# Altium schematic sheet DAC.SchDoc
size Tabloid; DocumentNumber: 7; SheetNumber: 7; SheetTotal: 11; SheetName: DAC
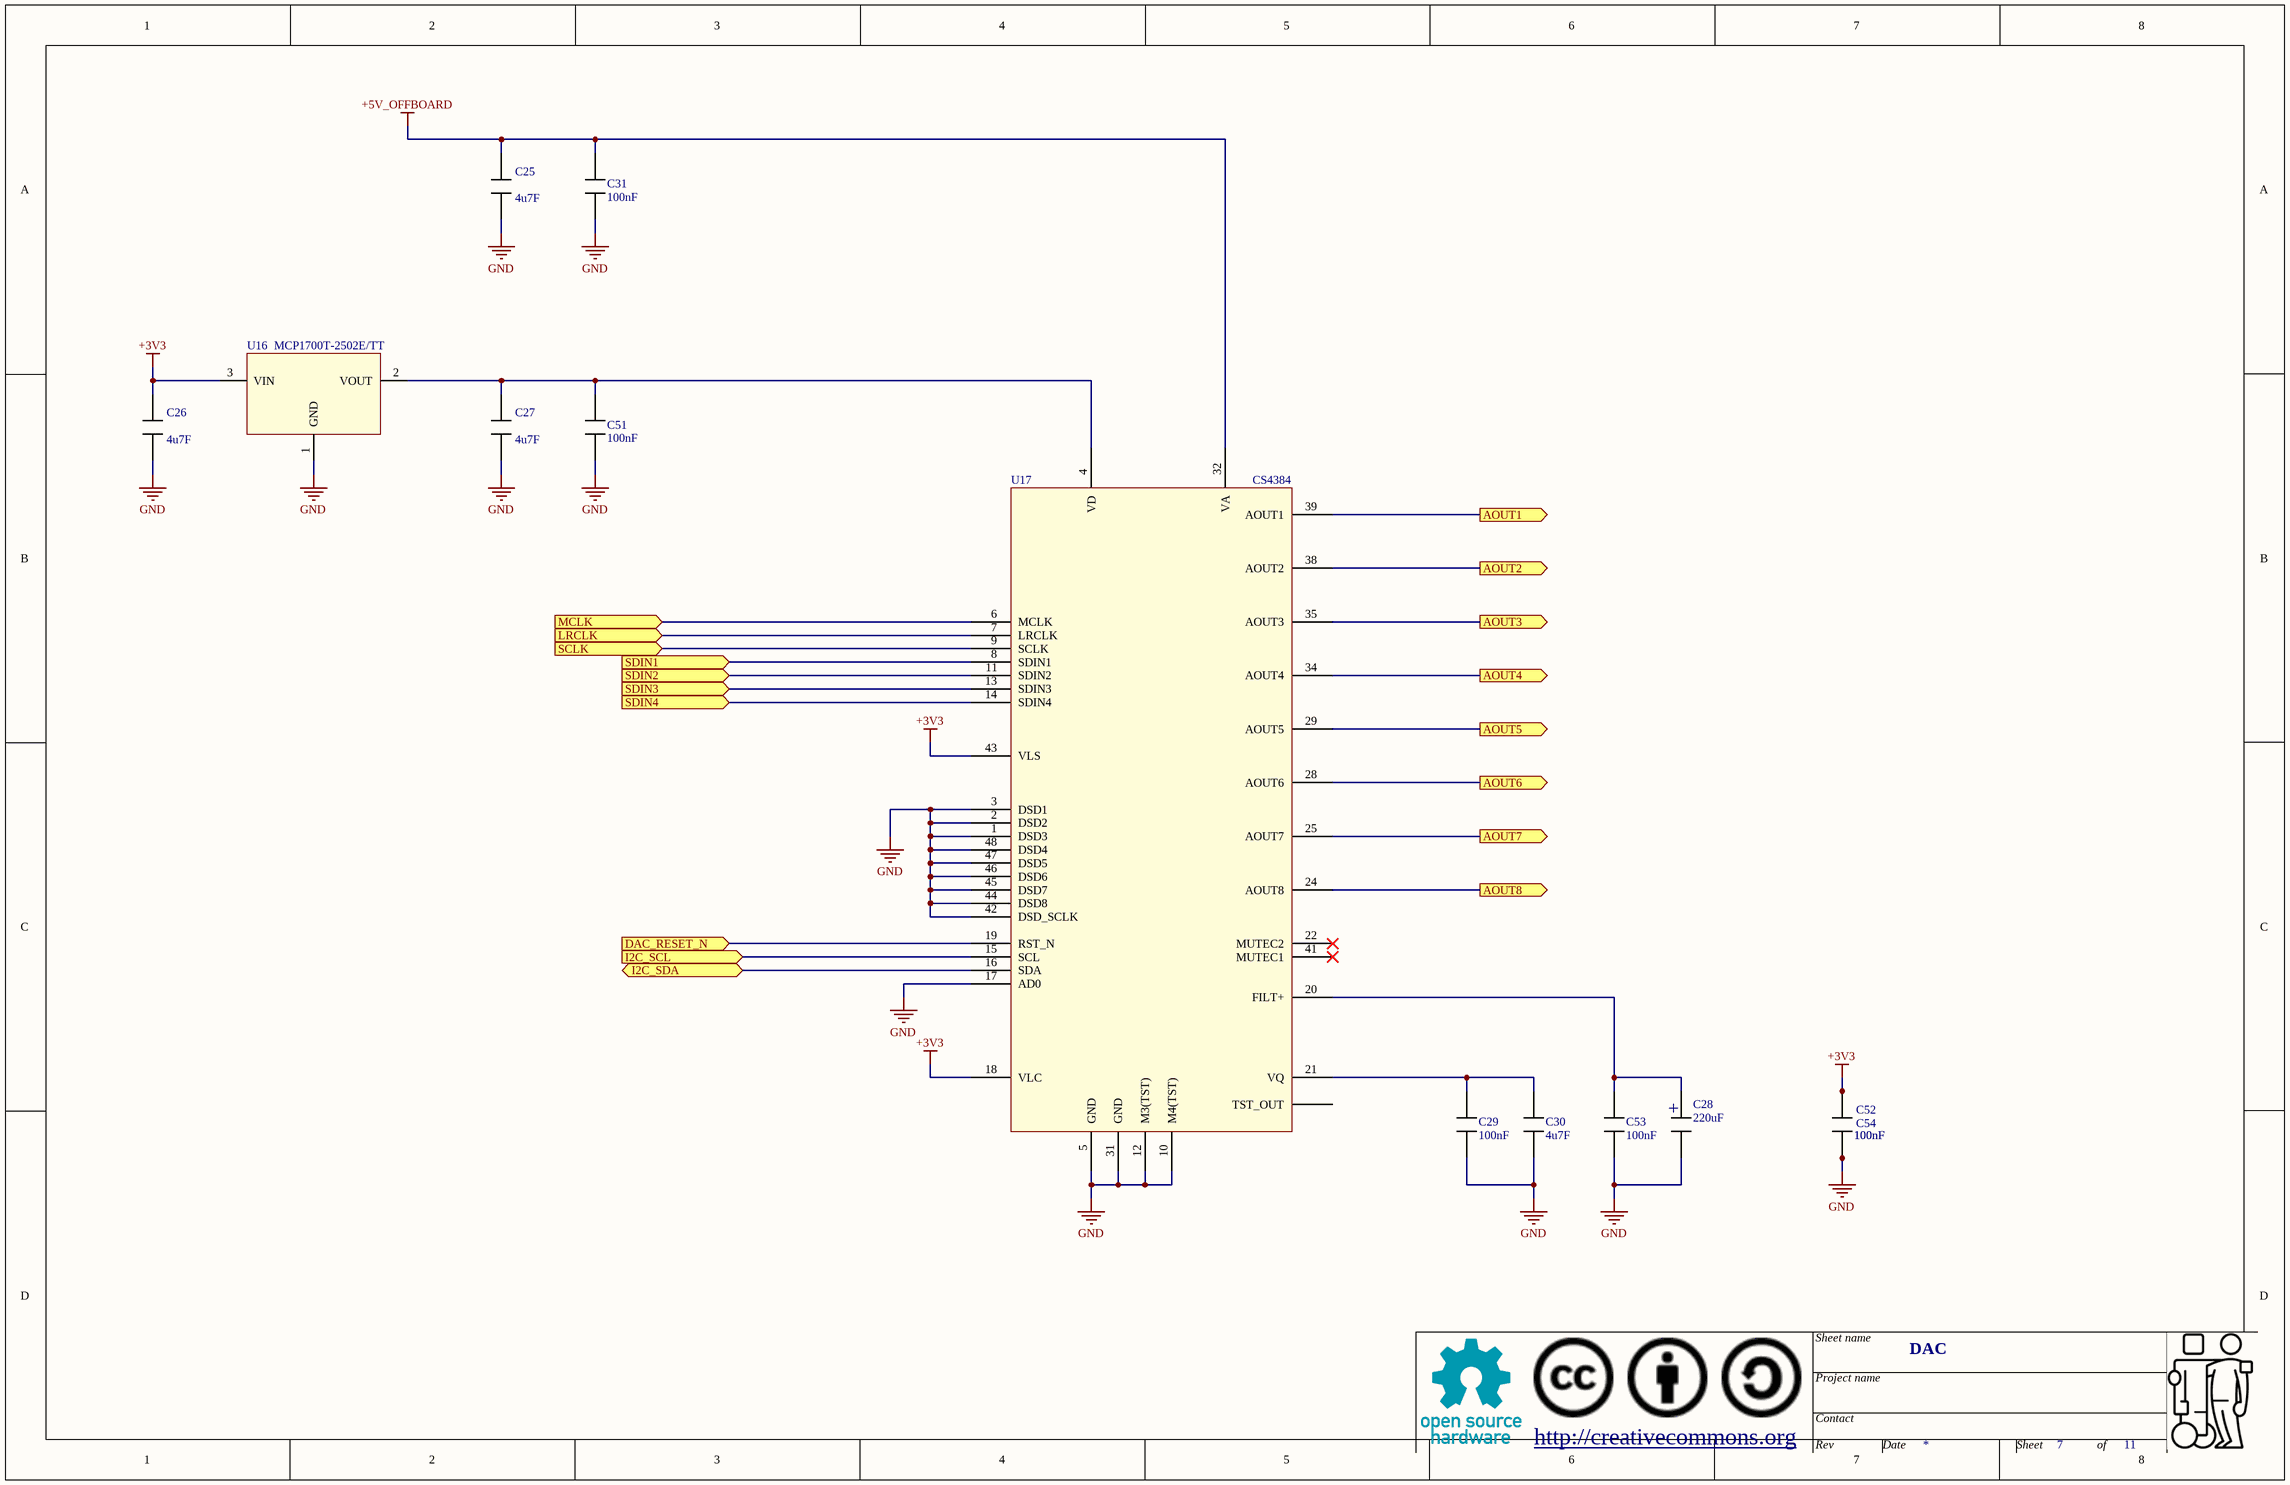
[diagram p0: DAC.SchDoc]

## Parts
C25  value 4u7F  [0805]  (hidden comment: Capacitor)
C26  value 4u7F  [0805]  (hidden comment: Capacitor)
C27  value 4u7F  [0805]  (hidden comment: Capacitor)
C28  value 220uF  [CAP_RAD_SMD_DIA315]  (hidden comment: Capacitor_Polarized)
C29  value 100nF  [0603]  (hidden comment: Capacitor)
C30  value 4u7F  [0805]  (hidden comment: Capacitor)
C31  value 100nF  [0603]  (hidden comment: Capacitor)
C51  value 100nF  [0603]  (hidden comment: Capacitor)
C52  value 100nF  [0603]  (hidden comment: Capacitor)
C53  value 100nF  [0603]  (hidden comment: Capacitor)
C54  value 100nF  [0603]  (hidden comment: Capacitor)
U16  Mfg_PN: MCP1700T-2502E/TT  [SOT23_132]  (hidden comment: MCP1700)
U17  CS4384  [LQFP_48L_CIRRUS]

## Ports
AOUT1 (out), AOUT2 (out), AOUT3 (out), AOUT4 (out), AOUT5 (out), AOUT6 (out), AOUT7 (out), AOUT8 (out), DAC_RESET_N (in), I2C_SCL (in), I2C_SDA (bidir), LRCLK (in), MCLK (in), SCLK (in), SDIN1 (in), SDIN2 (in), SDIN3 (in), SDIN4 (in)

## Nets
+3V3: C26.1 C52.1 C54.1 U16.3(VIN) U17.18(VLC) U17.43(VLS)
+5V_OFFBOARD: C25.1 C31.1 U17.32(VA)
GND: C25.2 C26.2 C27.2 C28.- C29.2 C30.2 C31.2 C51.2 C52.2 C53.2 C54.2 U16.1(GND) U17.1(DSD3) U17.2(DSD2) U17.3(DSD1) U17.5(GND) U17.10(M4(TST)) U17.12(M3(TST)) U17.17(AD0) U17.31(GND) U17.42(DSD_SCLK) U17.44(DSD8) U17.45(DSD7) U17.46(DSD6) U17.47(DSD5) U17.48(DSD4)
AOUT1: U17.39(AOUT1) ; port AOUT1
AOUT2: U17.38(AOUT2) ; port AOUT2
AOUT3: U17.35(AOUT3) ; port AOUT3
AOUT4: U17.34(AOUT4) ; port AOUT4
AOUT5: U17.29(AOUT5) ; port AOUT5
AOUT6: U17.28(AOUT6) ; port AOUT6
AOUT7: U17.25(AOUT7) ; port AOUT7
AOUT8: U17.24(AOUT8) ; port AOUT8
DAC_RESET_N: U17.19(RST_N) ; port DAC_RESET_N
I2C_SCL: U17.15(SCL) ; port I2C_SCL
I2C_SDA: U17.16(SDA) ; port I2C_SDA
LRCLK: U17.7(LRCLK) ; port LRCLK
MCLK: U17.6(MCLK) ; port MCLK
SCLK: U17.9(SCLK) ; port SCLK
SDIN1: U17.8(SDIN1) ; port SDIN1
SDIN2: U17.11(SDIN2) ; port SDIN2
SDIN3: U17.13(SDIN3) ; port SDIN3
SDIN4: U17.14(SDIN4) ; port SDIN4
NetC27_1: C27.1 C51.1 U16.2(VOUT) U17.4(VD)
NetC28_+: C28.+ C53.1 U17.20(FILT+)
NetC29_1: C29.1 C30.1 U17.21(VQ)

Not connected (* = marked no-connect by the designer): U17 22(MUTEC2)* 23(TST_OUT) 26(TST_OUT) 27(TST_OUT) 30(TST_OUT) 33(TST_OUT) 36(TST_OUT) 37(TST_OUT) 40(TST_OUT) 41(MUTEC1)*

## Notes on the sheet
- Sheet name
- http://creativecommons.org
- Project name
- Contact
- Rev
- Date
- Sheet
- of

## Library data of the parts
C25-C27 C30 = Capacitor: Mfg: Samsung; Mfg_PN: CL21A475KAQNNNG; HelpURL: *; NI: *; Supplier1: Digikey; Supplier1_PN: 1276-6462-1-ND; Tolerance: *; Type: *; Rating: *
C28 = Capacitor_Polarized: Capacitor; Mfg: Nichicon; Mfg_PN: UWT1E221MNL1GS; HelpURL: *; NI: *; Supplier1: Digikey; Supplier1_PN: 493-2192-1-ND; Tolerance: *; Type: *; Rating: *
C29 C31 C51-C54 = Capacitor: Mfg: Samsung; Mfg_PN: CL10F104ZO8NNNC; HelpURL: *; NI: *; Supplier1: Digikey; Supplier1_PN: 1276-1258-1-ND; Tolerance: *; Type: *; Rating: *
U16 = MCP1700: Linear voltage regulator; Mfg: Microchip; HelpURL: http://ww1.microchip.com/downloads/en/DeviceDoc/20001826C.pdf; NI: *; Supplier1: Digikey; Supplier1_PN: MCP1700T-2502E/TTCT-ND; Type: *
U17 = CS4384: DAC, 24-bit, 8 chan, 192kHz, PCM, TDM, DSD, LQFP48; Mfg: Cirrus; Mfg_PN: CS4384-CQZ; Supplier1: Digikey; Supplier1_PN: 598-1062-ND